# EasyEDA Pro project NanoCore.eprj

# Schematic Schematic1
Board Name: Board1; Create Date: 2024-04-27; Page Name: P1; Project Name: NanoCore; Schematic Name: Schematic1; Update Date: 2024-06-27; Company: 嘉立创EDA; Page Size: A2; Version: V1.0
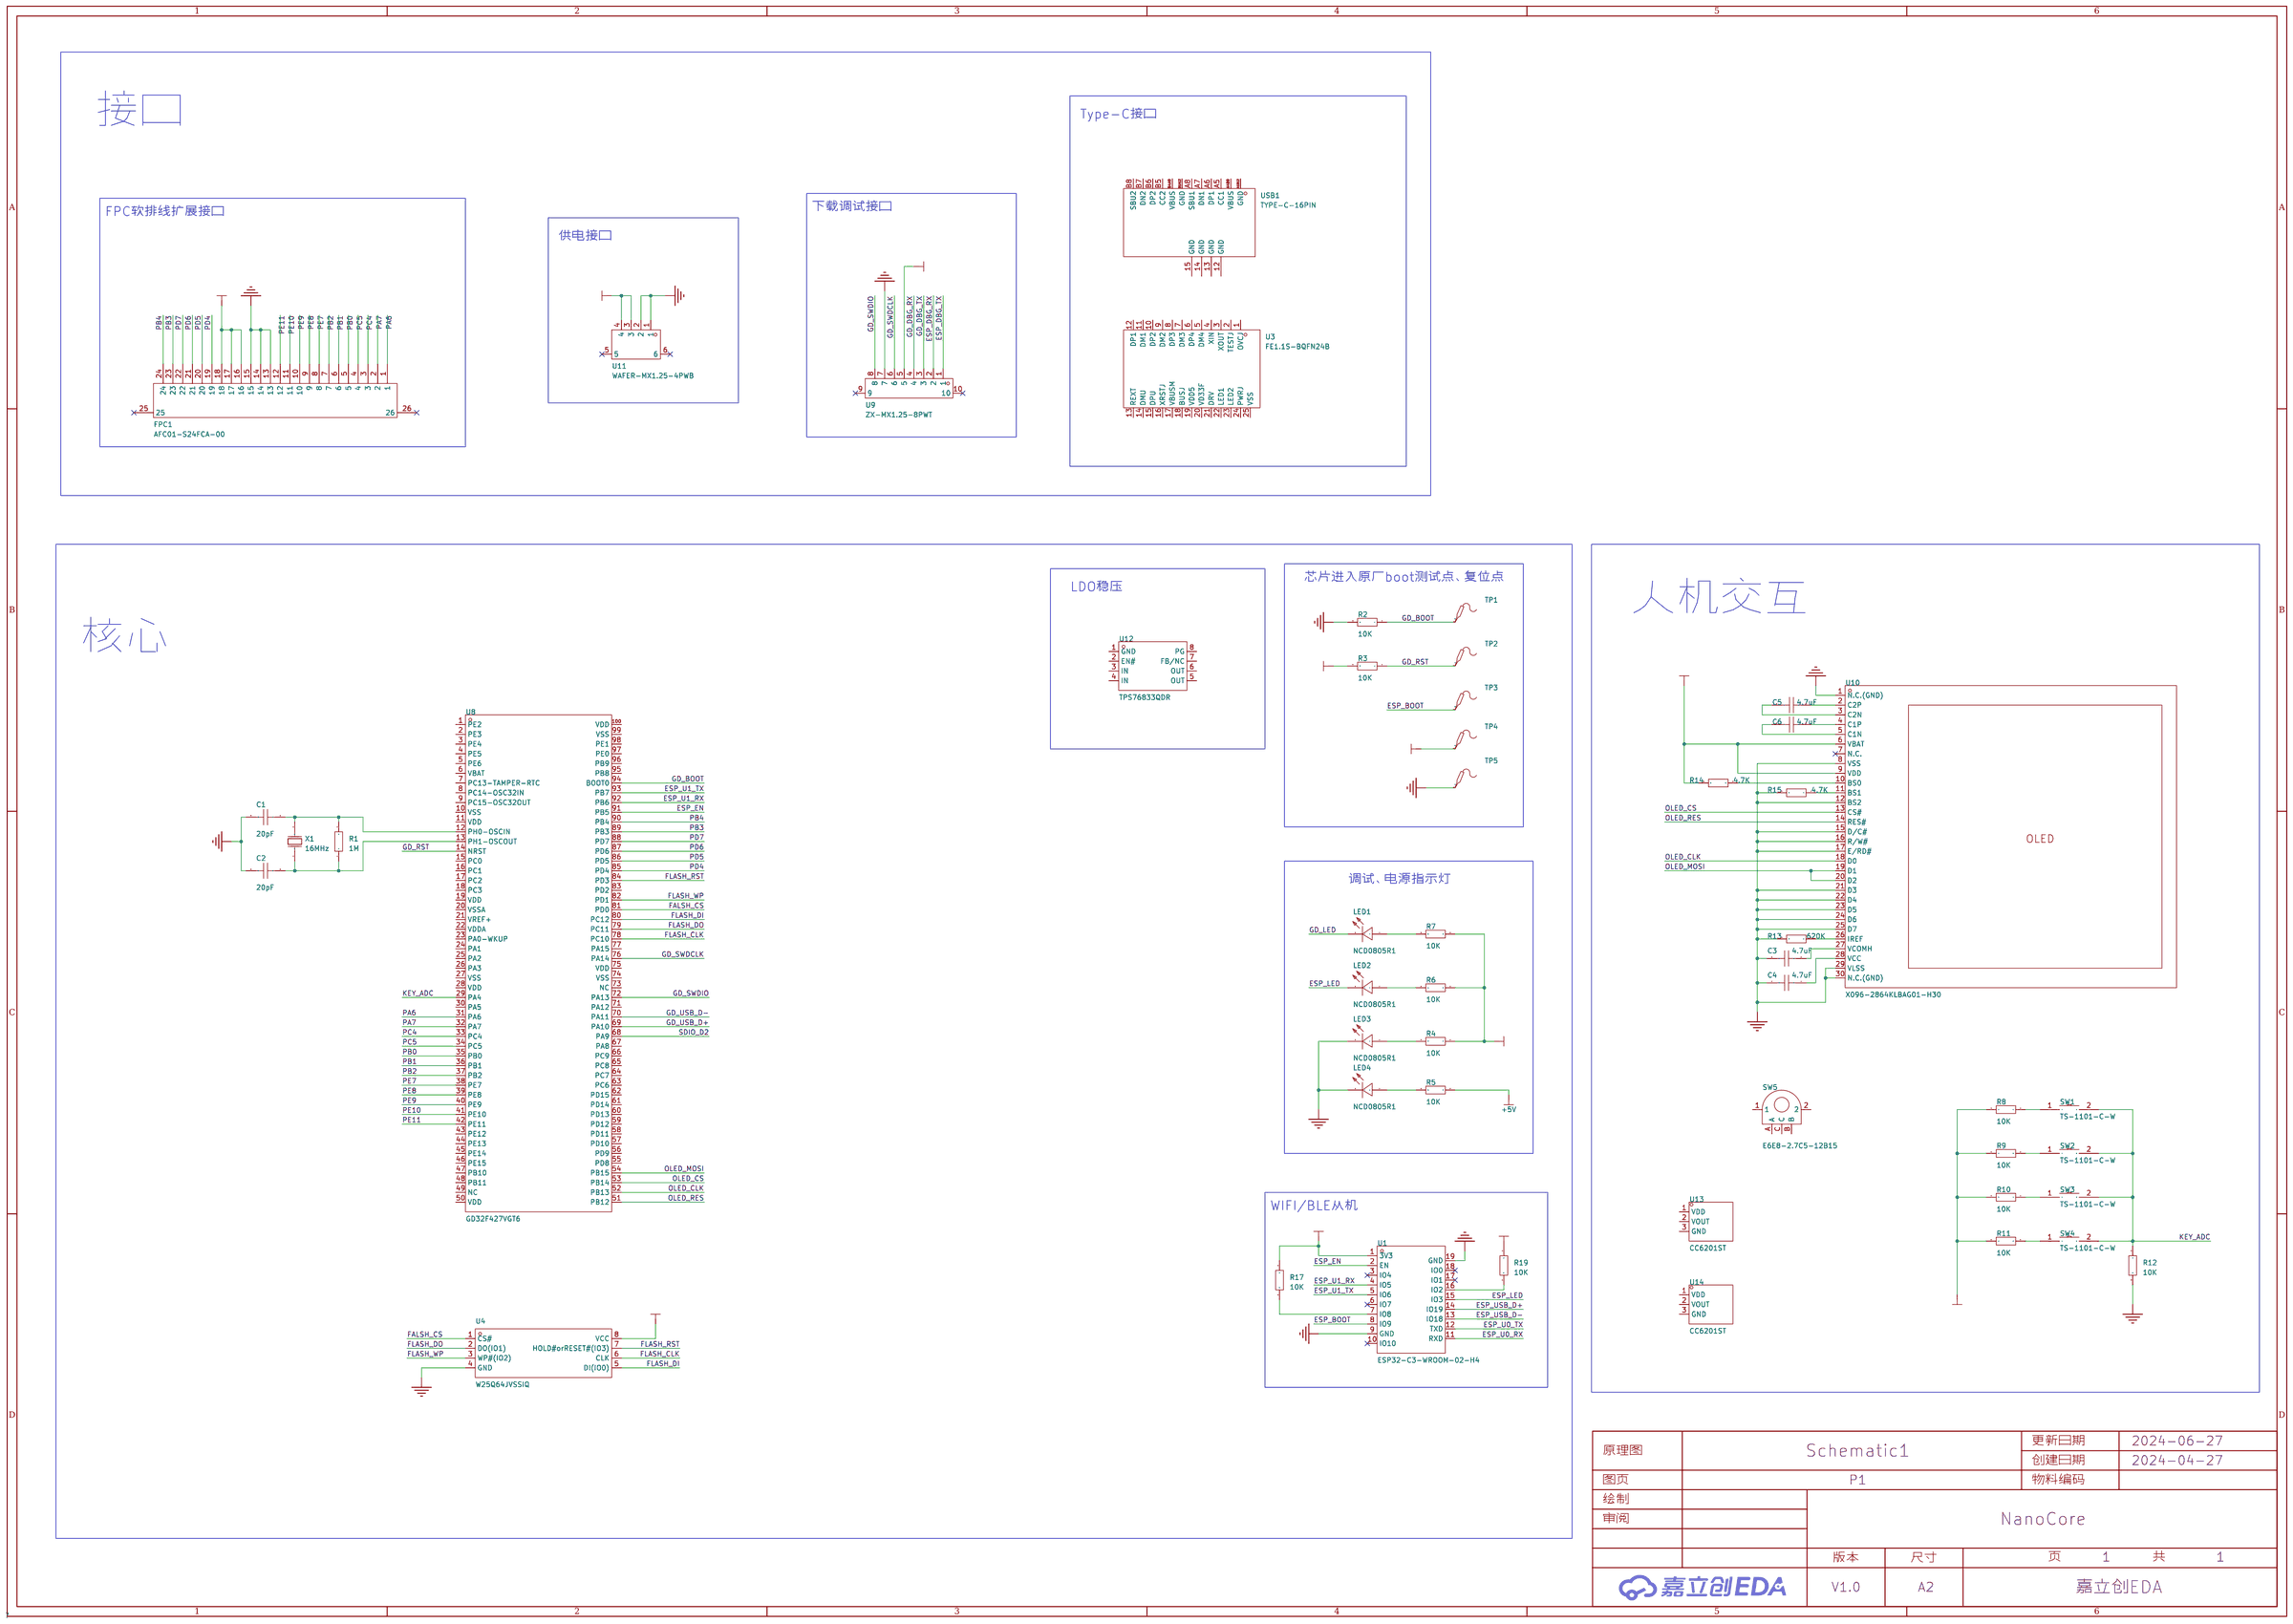
[diagram p0: schematic sheet]

## Parts
C1  20pF  [C0603]
C2  20pF  [C0603]
C3  4.7uF  [C0603]
C4  4.7uF  [C0603]
C5  4.7uF  [C0603]
C6  4.7uF  [C0603]
FPC1  AFC01-S24FCA-00  [FPC-SMD_P0.50-24P_FGS-XJ-H2.0]
LED1  NCD0805R1  [LED0805-R-RD]
LED2  NCD0805R1  [LED0805-R-RD]
LED3  NCD0805R1  [LED0805-R-RD]
LED4  NCD0805R1  [LED0805-R-RD]
R1  1M  [R0805]
R2  10K  [R0805]
R3  10K  [R0805]
R4  10K  [R0805]
R5  10K  [R0805]
R6  10K  [R0805]
R7  10K  [R0805]
R8  10K  [R0805]
R9  10K  [R0805]
R10  10K  [R0805]
R11  10K  [R0805]
R12  10K  [R0805]
R13  620K  [R0805]
R14  4.7K  [R0805]
R15  4.7K  [R0805]
R17  10K  [R0805]
R19  10K  [R0805]
SW1  TS-1101-C-W  [SW-SMD_L6.0-W3.3-LS8.0]
SW2  TS-1101-C-W  [SW-SMD_L6.0-W3.3-LS8.0]
SW3  TS-1101-C-W  [SW-SMD_L6.0-W3.3-LS8.0]
SW4  TS-1101-C-W  [SW-SMD_L6.0-W3.3-LS8.0]
SW5  E6E8-2.7C5-12B15  [SW-SMD_L5.7-W5.7-P2.00-LS6.9]
TP1  -  [Test-Point-0.5mm]
TP2  -  [Test-Point-0.5mm]
TP3  -  [Test-Point-0.5mm]
TP4  -  [Test-Point-0.5mm]
TP5  -  [Test-Point-0.5mm]
U1  ESP32-C3-WROOM-02-H4  [WIFIM-SMD_18P-L20.0-W18.0-P1.50]
U3  FE1.1S-BQFN24B  [WQFN-24_L4.0-W4.0-P0.50-TL-EP2.7]
U4  W25Q64JVSSIQ  [SOIC-8_L5.3-W5.3-P1.27-LS8.0-BL]
U8  GD32F427VGT6  [LQFP-100_L14.0-W14.0-P0.50-LS16.0-TL]
U9  ZX-MX1.25-8PWT  [CONN-SMD_8P-P1.25_ZX-MX1.25-8PWT]
U10  X096-2864KLBAG01-H30  [OLED-SMD_X096-2864KLBAG01-H30]
U11  WAFER-MX1.25-4PWB  [CONN-SMD_4P-P1.25_WAFER-MX1.25-4PWB]
U12  TPS76833QDR  [SOIC-8_L4.9-W3.9-P1.27-LS6.0-BL]
U13  CC6201ST  [SOT-23-3_L2.9-W1.3-P1.90-LS2.4-BR]
U14  CC6201ST  [SOT-23-3_L2.9-W1.3-P1.90-LS2.4-BR]
USB1  TYPE-C-16PIN  [USB-SMD_TYPEC-16PIN]
X1  16MHz  [SMD-5032_2P]

## Library data of the parts
C1-C6 = CC0603KRX7R9BB104: 容值:100nF;精度:±10%;额定电压:50V;材质(温度系数):X7R;; LCSC Part Name: 100nF ±10% 50V; Supplier Part: C14663; Manufacturer: YAGEO(国巨); Supplier Footprint: 0603; JLCPCB Part Class: 基础库; Datasheet: https://atta.szlcsc.com/upload/public/pdf/source/20180910/C282072_33301C7F631E79921B82A8DAC6BCC5B3.pdf; Supplier: LCSC; Tolerance: ±10%; Voltage Rated: 50V; Temperature Coefficient: X7R
FPC1 = AFC01-S24FCA-00: 锁定特性:翻盖式;触点类型:下接;触点数量:24P;间距:0.5mm;安装类型:卧贴;; LCSC Part Name: 间距:0.5mm P数:24P 翻盖式 下接; Supplier Part: C262669; Manufacturer: JS(钜硕电子); Supplier Footprint: SMD,P=0.5mm,卧贴; JLCPCB Part Class: 扩展库; Datasheet: https://atta.szlcsc.com/upload/public/pdf/source/20190816/C413942_2A72D1AC756EAE17EEDF756A339D4500.pdf; Supplier: LCSC; Locking Feature: 翻盖式; Contact Type: 下接; Number of Contacts: 24P; Pitch: 0.5mm; Mounting Type: 卧贴; FFC, FCB Thickness: 0.3mm; Height Above Board: 2mm
LED1-LED4 = NCD0805R1: 灯头类型:-;发光颜色:红色;正向电压(VF):1.6V~2.6V;功率:65mW;正向电流:20mA;主波长:615nm~630nm;二极管配置:独立二极管;透镜颜色:无色透明透镜;色温:-;发光强度:67mcd~195mcd;发光角度:130°;载带方式:-;工作温度:-30℃~+85℃;; Supplier Part: C84256; Manufacturer: 国星光电; Supplier Footprint: 0805; JLCPCB Part Class: 基础库; Datasheet: https://atta.szlcsc.com/upload/public/pdf/source/20200820/C84256_F0A75A43B3EAD75808600A0514C76B99.pdf; Supplier: LCSC; Emitted Color: 红色; Forward Voltage (VF): 1.6V~2.6V; Power Dissipation: 65mW; Forward Current: 20mA; Dominant Wavelength: 615nm~630nm; Diode Configuration: 独立二极管; Lens Color: 无色透明透镜; Luminous Intensity: 67mcd~195mcd; Viewing Angle: 130°; Operating Temperature: -30℃~+85℃
R1-R15 R17 R19 = 0805W8F1002T5E_C17414: 电阻类型:厚膜电阻;阻值:10kΩ;精度:±1%;功率:125mW;最大工作电压:150V;温度系数:±100ppm/℃;; LCSC Part Name: 10kΩ ±1% 125mW 厚膜电阻; Supplier Part: C17414; Manufacturer: UNI-ROYAL(厚声); Manufacturer Part: 0805W8F1002T5E; Supplier Footprint: 0805; JLCPCB Part Class: 基础库; Datasheet: https://atta.szlcsc.com/upload/public/pdf/source/20200306/C422600_1E6D84923E4A46A82E41ADD87F860B5C.pdf; Supplier: LCSC; Type: 厚膜电阻; Tolerance: ±1%; Power(Watts): 125mW; Overload Voltage (Max): 150V; Temperature Coefficient: ±100ppm/℃; Operating Temperature Range: -55℃~+155℃
SW1-SW4 = TS-1101-C-W: 电路结构:单刀单掷;按钮形状:矩形按钮;作用力:260gf;安装方式:立贴;开关长度:6mm;开关宽度:3.6mm;开关高度:2.5mm;带支架:不带;触点电流:50mA;额定电压(AC):-;额定电压(DC):12V;额定功率:-;绝缘电阻:-;带灯:无;机械寿命:5万次;; LCSC Part Name: 6*3.6*2.5mm 立贴 轻触开关; Supplier Part: C318938; Manufacturer: XKB Connectivity(中国星坤); Supplier Footprint: SMD; JLCPCB Part Class: 扩展库; Datasheet: https://atta.szlcsc.com/upload/public/pdf/source/20200227/C318938_C2E53B1EEDE37D980A33616AC086DE53.pdf; Supplier: LCSC; Circuit: 单刀单掷; Actuator Style: 矩形按钮; Operating Force: 260gf; Mounting Style: 立贴; Switch Length: 6mm; Switch Width: 3.6mm; Switch Height: 2.5mm; Strike Gundam: 不带; Contact Current: 50mA; Voltage Rating (DC): 12V; Actuator/Cap Color: 白色带淡绿; With Lamp: 无; Mechanical Life: 5万次; Operating Temperature: -30℃~+85℃
SW5 = E6E8-2.7C5-12B15: LCSC Part Name: EC05E超小型编码器-有齿感; Supplier Part: C976312; Manufacturer: G-Switch(品赞); Supplier Footprint: SMD; JLCPCB Part Class: 扩展库; Datasheet: https://atta.szlcsc.com/upload/public/pdf/source/20201217/C976312_DD4A6923E7C1439EBA78B6A33AF4F919.pdf; Supplier: LCSC
TP1-TP5 = Test-Point: Test Point 测试点
U1 = ESP32-C3-WROOM-02-H4: Supplier Part: C2944070; Manufacturer: ESPRESSIF(乐鑫); Supplier Footprint: SMD-32P; JLCPCB Part Class: 扩展库; Datasheet: https://atta.szlcsc.com/upload/public/pdf/source/20220106/F07459EFFE1D7CBA94B4FB8A075146A6.pdf; Supplier: LCSC
U3 = FE1.1S-BQFN24B: Supplier Part: C6776948; Manufacturer: TERMINUS; Supplier Footprint: WQFN-24; JLCPCB Part Class: 扩展库; Datasheet: https://atta.szlcsc.com/upload/public/pdf/source/20230614/ED67D6CC784350C7C68F98E68B5A1A46.pdf; Supplier: LCSC
U4 = W25Q64JVSSIQ: Supplier Part: C179171; Manufacturer: WINBOND(华邦); Supplier Footprint: SOIC-8-208mil; JLCPCB Part Class: 扩展库; Datasheet: https://atta.szlcsc.com/upload/public/pdf/source/20191218/C179171_92C5C91D0324539EDD8F1160D2E79C0F.pdf; Supplier: LCSC
U8 = GD32F427VGT6: CPU内核:CM4;程序存储容量:1MB;RAM总容量:256KB;GPIO端口数量:82;工作电压范围:-;CPU最大主频:200MHz;程序存储器类型:FLASH;; Supplier Part: C2981721; Manufacturer: GigaDevice(兆易创新); Supplier Footprint: LQFP-100(14x14); JLCPCB Part Class: 扩展库; Datasheet: https://atta.szlcsc.com/upload/public/pdf/source/20220531/A46283AC2B9B66CE0B8C72CFC5C6EAE2.pdf; Supplier: LCSC; CPU Core: CM4; Program Storage Size: 1MB; RAM Size: 256KB; GPIO Ports Number: 82; CPU Maximum Speed: 200MHz; Program Memory Type: FLASH; ADC (Bit): 12bit; DAC (Bit): 12bit; 16Bit Timer: 12; 32Bit Timer: 2; CAN: 2; UART/USART: 6; I2C: 3; I2S: 2; SPI: 3; Universal Serial Bus: 有; Peripheral/Function: 看门狗；SDIO；RTC实时时钟; Watchdog: 有; Real-Time Clock: 有; Secure Digital Input and Output: 有
U9 = ZX-MX1.25-8PWT: 插针结构:1x8P;间距:1.25mm;安装方式:卧贴;参考系列:-;总PIN数:8P;排数:1;每排PIN数:8;行距:-;额定电流:1A;触头材质:黄铜;触头镀层:锡;工作温度范围:-25℃~+85℃;; LCSC Part Name: 1x8P 间距:1.25mm 卧贴; Supplier Part: C19272381; Manufacturer: Megastar(兆星); Supplier Footprint: SMD,P=1.25mm,卧贴; JLCPCB Part Class: 扩展库; Datasheet: https://atta.szlcsc.com/upload/public/pdf/source/20231201/7A0E4B8E8DD57392260B4DFAD27BB681.pdf; Supplier: LCSC; Pins Structure: 1x8P; Pitch: 1.25mm; Mounting Style: 卧贴; Number of Pins: 8P; Number of Rows: 1; Number of PINs Per Row: 8; Current Rating (Max): 1A; Contact Material: 黄铜; Contact Plating: 锡; Operating Temperature Range: -25℃~+85℃
U10 = X096-2864KLBAG01-H30: 主控芯片:SSD1315;尺寸(inch):0.96;像素分辨率:128x64;; LCSC Part Name: 0.96寸 蓝光 128x64像素分辨率 30PIN; Supplier Part: C4944144; Manufacturer: Newvision(新智景); JLCPCB Part Class: Extended Part; Datasheet: https://atta.szlcsc.com/upload/public/pdf/source/20220811/AFF42A01440844B6AF7EF5D26E15DF13.pdf; Supplier: LCSC; Main Control Chip: SSD1315; Size: 0.96; Pixel Resolution: 128x64; Operating Temperature: -40℃~+85℃
U11 = WAFER-MX1.25-4PWB: 插针结构:1x4P;间距:1.25mm;安装方式:卧贴;总PIN数:4P;排数:1;每排PIN数:4;额定电流:1A;工作温度范围:-25℃~+85℃;; LCSC Part Name: 1x4P 间距:1.25mm 卧贴; Supplier Part: C3029361; Manufacturer: XUNPU(讯普); Supplier Footprint: SMD,P=1.25mm,卧贴; JLCPCB Part Class: 扩展库; Datasheet: https://atta.szlcsc.com/upload/public/pdf/source/20220527/5ACBB683E384B6AD06743F272F933620.pdf; Supplier: LCSC; Pins Structure: 1x4P; Pitch: 1.25mm; Mounting Style: 卧贴; Number of Pins: 4P; Number of Rows: 1; Number of PINs Per Row: 4; Current Rating (Max): 1A; Operating Temperature Range: -25℃~+85℃
U12 = TPS76833QDR: LCSC Part Name: 具有电源正常指示和使能功能的 1A、10V、低压降稳压器; Supplier Part: C16002; Manufacturer: TI(德州仪器); Supplier Footprint: SOIC-8; JLCPCB Part Class: 扩展库; Datasheet: https://www.ti.com/cn/lit/gpn/tps768; Supplier: LCSC; Output Type: 固定; Maximum Input Voltage: 10V; Output Voltage: 3.3V; Output Current: 1A; Power Supply Rejection Ratio (PSRR): 60dB@(1kHz); Dropout Voltage: 575mV@(1A); standby current: 125uA; Feature: 防静电保护；开漏电源正常 (PG) 输出；低ESR；热保护(TSD)；过流保护(OCP)；带使能；防倒灌; Operating Temperature: -40℃~+125℃; Output Polarity: 正极; Number of Outputs: 1
U13 U14 = CC6201ST: LCSC Part Name: 霍尔效应开关; Supplier Part: C285995; Manufacturer: CrossChip(成都芯进); Supplier Footprint: TSOT-23-3; JLCPCB Part Class: 扩展库; Datasheet: https://atta.szlcsc.com/upload/public/pdf/source/20180919/C285996_9641046DC0D68E54233000F429BA026E.pdf; Supplier: LCSC
USB1 = CONNECTOR,USB,TYPEC,RTANG,16PIN: Supplier Part: C9900022254; Supplier Footprint: USBTypeC; JLCPCB Part Class: 扩展库; Supplier: LCSC
X1 = X50328MSB2GI: 晶振类型:贴片晶振;频率:8MHz;常温频差:±10ppm;外接负载电容:20pF;频率稳定度(全温):±20ppm;; LCSC Part Name: 8MHz ±10ppm 20pF YSX530GA; Supplier Part: C115962; Manufacturer: YXC(扬兴晶振); Supplier Footprint: SMD5032; JLCPCB Part Class: 基础库; Datasheet: https://atta.szlcsc.com/upload/public/pdf/source/20240329/44922B0AF7B60E58E9B66993B6077277.pdf; Supplier: LCSC; Crystal Type: 贴片晶振; Normal temperature Frequency Tolerance: ±10ppm; External load capacitor: 20pF; Frequency Stability(Full temperature range): ±20ppm; Operating Temperature: -40℃~+85℃

## Nets
+5V: R5.1
GND: C1.2 C2.2 C3.2 C4.2 FPC1.13 FPC1.14 FPC1.15 LED3.2(-) LED4.2(-) R2.2 R12.2 R13.2 R15.2 TP5.1 U1.9(GND) U1.19(GND) U4.4(GND) U9.7 U10.1(N.C.(GND)) U10.8(VSS) U10.12(BS2) U10.15(D/C#) U10.16(R/W#) U10.17(E/RD#) U10.21(D3) U10.22(D4) U10.23(D5) U10.24(D6) U10.25(D7) U10.29(VLSS) U10.30(N.C.(GND)) U11.1 U11.2
VCC_5V: U11.3 U11.4
VDD_3V3: FPC1.16 FPC1.17 FPC1.18 R3.2 R4.1 R6.1 R7.1 R8.2 R9.2 R10.2 R11.2 R14.2 R17.1 R19.1 TP4.1 U1.1(3V3) U4.8(VCC) U9.5 U10.6(VBAT) U10.9(VDD)
ESP_BOOT: TP3.1 U1.8(IO9)
ESP_DBG_RX: U9.2
ESP_DBG_TX: U9.1
ESP_EN: U1.2(EN) U8.91(PB5)
ESP_LED: LED2.2(-) U1.15(IO3)
ESP_U0_RX: U1.11(RXD)
ESP_U0_TX: U1.12(TXD)
ESP_U1_RX: U1.4(IO5) U8.92(PB6)
ESP_U1_TX: U1.5(IO6) U8.93(PB7)
ESP_USB_D+: U1.14(IO19)
ESP_USB_D-: U1.13(IO18)
FALSH_CS: U4.1(CS#) U8.81(PD0)
FLASH_CLK: U4.6(CLK) U8.78(PC10)
FLASH_DI: U4.5(DI(IO0)) U8.80(PC12)
FLASH_DO: U4.2(DO(IO1)) U8.79(PC11)
FLASH_RST: U4.7(HOLD#orRESET#(IO3)) U8.84(PD3)
FLASH_WP: U4.3(WP#(IO2)) U8.82(PD1)
GD_BOOT: R2.1 TP1.1 U8.94(BOOT0)
GD_DBG_RX: U9.4
GD_DBG_TX: U9.3
GD_LED: LED1.2(-)
GD_RST: R3.1 TP2.1 U8.14(NRST)
GD_SWDCLK: U8.76(PA14) U9.6
GD_SWDIO: U8.72(PA13) U9.8
GD_USB_D+: U8.69(PA10)
GD_USB_D-: U8.70(PA11)
KEY_ADC: R12.1 SW1.2 SW2.2 SW3.2 SW4.2 U8.29(PA4)
OLED_CLK: U8.52(PB13) U10.18(D0)
OLED_CS: U8.53(PB14) U10.13(CS#)
OLED_MOSI: U8.54(PB15) U10.19(D1) U10.20(D2)
OLED_RES: U8.51(PB12) U10.14(RES#)
PA6: FPC1.1 U8.31(PA6)
PA7: FPC1.2 U8.32(PA7)
PB0: FPC1.5 U8.35(PB0)
PB1: FPC1.6 U8.36(PB1)
PB2: FPC1.7 U8.37(PB2)
PB3: FPC1.23 U8.89(PB3)
PB4: FPC1.24 U8.90(PB4)
PC4: FPC1.3 U8.33(PC4)
PC5: FPC1.4 U8.34(PC5)
PD4: FPC1.19 U8.85(PD4)
PD5: FPC1.20 U8.86(PD5)
PD6: FPC1.21 U8.87(PD6)
PD7: FPC1.22 U8.88(PD7)
PE7: FPC1.8 U8.38(PE7)
PE8: FPC1.9 U8.39(PE8)
PE9: FPC1.10 U8.40(PE9)
PE10: FPC1.11 U8.41(PE10)
PE11: FPC1.12 U8.42(PE11)
SDIO_D2: U8.68(PA9)
Net-(C1-1): C1.1 R1.2 U8.12(PH0-OSCIN) X1.2(OSC2)
Net-(C2-1): C2.1 R1.1 U8.13(PH1-OSCOUT) X1.1(OSC1)
Net-(C3-1): C3.1 U10.27(VCOMH)
Net-(C4-1): C4.1 U10.28(VCC)
Net-(C5-1): C5.1 U10.3(C2N)
Net-(C5-2): C5.2 U10.2(C2P)
Net-(C6-1): C6.1 U10.5(C1N)
Net-(C6-2): C6.2 U10.4(C1P)
Net-(LED1-1): LED1.1(+) R7.2
Net-(LED2-1): LED2.1(+) R6.2
Net-(LED3-1): LED3.1(+) R4.2
Net-(LED4-1): LED4.1(+) R5.2
Net-(R8-1): R8.1 SW1.1
Net-(R9-1): R9.1 SW2.1
Net-(R10-1): R10.1 SW3.1
Net-(R11-1): R11.1 SW4.1
Net-(R13-1): R13.1 U10.26(IREF)
Net-(R14-1): R14.1 U10.10(BS0)
Net-(R15-1): R15.1 U10.11(BS1)
Net-(R17-2): R17.2 U1.7(IO8)
Net-(R19-2): R19.2 U1.16(IO2)

Not connected (* = marked no-connect by the designer): FPC1 25* 26*; SW5 1 2 A B C; U1 3(IO4)* 6(IO7)* 10(IO10)* 17(IO1)* 18(IO0)*; U3 1(OVCJ) 2(TESTJ) 3(XOUT) 4(XIN) 5(DM4) 6(DP4) 7(DM3) 8(DP3) 9(DM2) 10(DP2) 11(DM1) 12(DP1) 13(REXT) 14(DMU) 15(DPU) 16(XRSTJ) 17(VBUSM) 18(BUSJ) 19(VDD5) 20(VD33F) 21(DRV) 22(LED1) 23(LED2) 24(PWRJ) 25(VSS); U8 1(PE2) 2(PE3) 3(PE4) 4(PE5) 5(PE6) 6(VBAT) 7(PC13-TAMPER-RTC) 8(PC14-OSC32IN) 9(PC15-OSC32OUT) 10(VSS) 11(VDD) 15(PC0) 16(PC1) 17(PC2) 18(PC3) 19(VDD) 20(VSSA) 21(VREF+) 22(VDDA) 23(PA0-WKUP) 24(PA1) 25(PA2) 26(PA3) 27(VSS) 28(VDD) 30(PA5) 43(PE12) 44(PE13) 45(PE14) 46(PE15) 47(PB10) 48(PB11) 49(NC) 50(VDD) 55(PD8) 56(PD9) 57(PD10) 58(PD11) 59(PD12) 60(PD13) 61(PD14) 62(PD15) 63(PC6) 64(PC7) 65(PC8) 66(PC9) 67(PA8) 71(PA12) 73(NC) 74(VSS) 75(VDD) 77(PA15) 83(PD2) 95(PB8) 96(PB9) 97(PE0) 98(PE1) 99(VSS) 100(VDD); U9 9* 10*; U10 7(N.C.)*; U11 5* 6*; U12 1(GND) 2(EN#) 3(IN) 4(IN) 5(OUT) 6(OUT) 7(FB/NC) 8(PG); U13 1(VDD) 2(VOUT) 3(GND); U14 1(VDD) 2(VOUT) 3(GND); USB1 12(GND) 13(GND) 14(GND) 15(GND) A1B12(GND) A4B9(VBUS) A5(CC1) A6(DP1) A7(DN1) A8(SBU1) B1A12(GND) B4A9(VBUS) B5(CC2) B6(DP2) B7(DN2) B8(SBU2)

## Notes on the sheet
- Type-C接口
- 接口
- 下载调试接口
- FPC软排线扩展接口
- 供电接口
- 芯片进入原厂boot测试点、复位点
- LDO稳压
- 人机交互
- 核心
- 调试、电源指示灯
- WIFI/BLE从机
